# EAGLE schematic RCM-PBB_E1 (EAGLE 6.2)
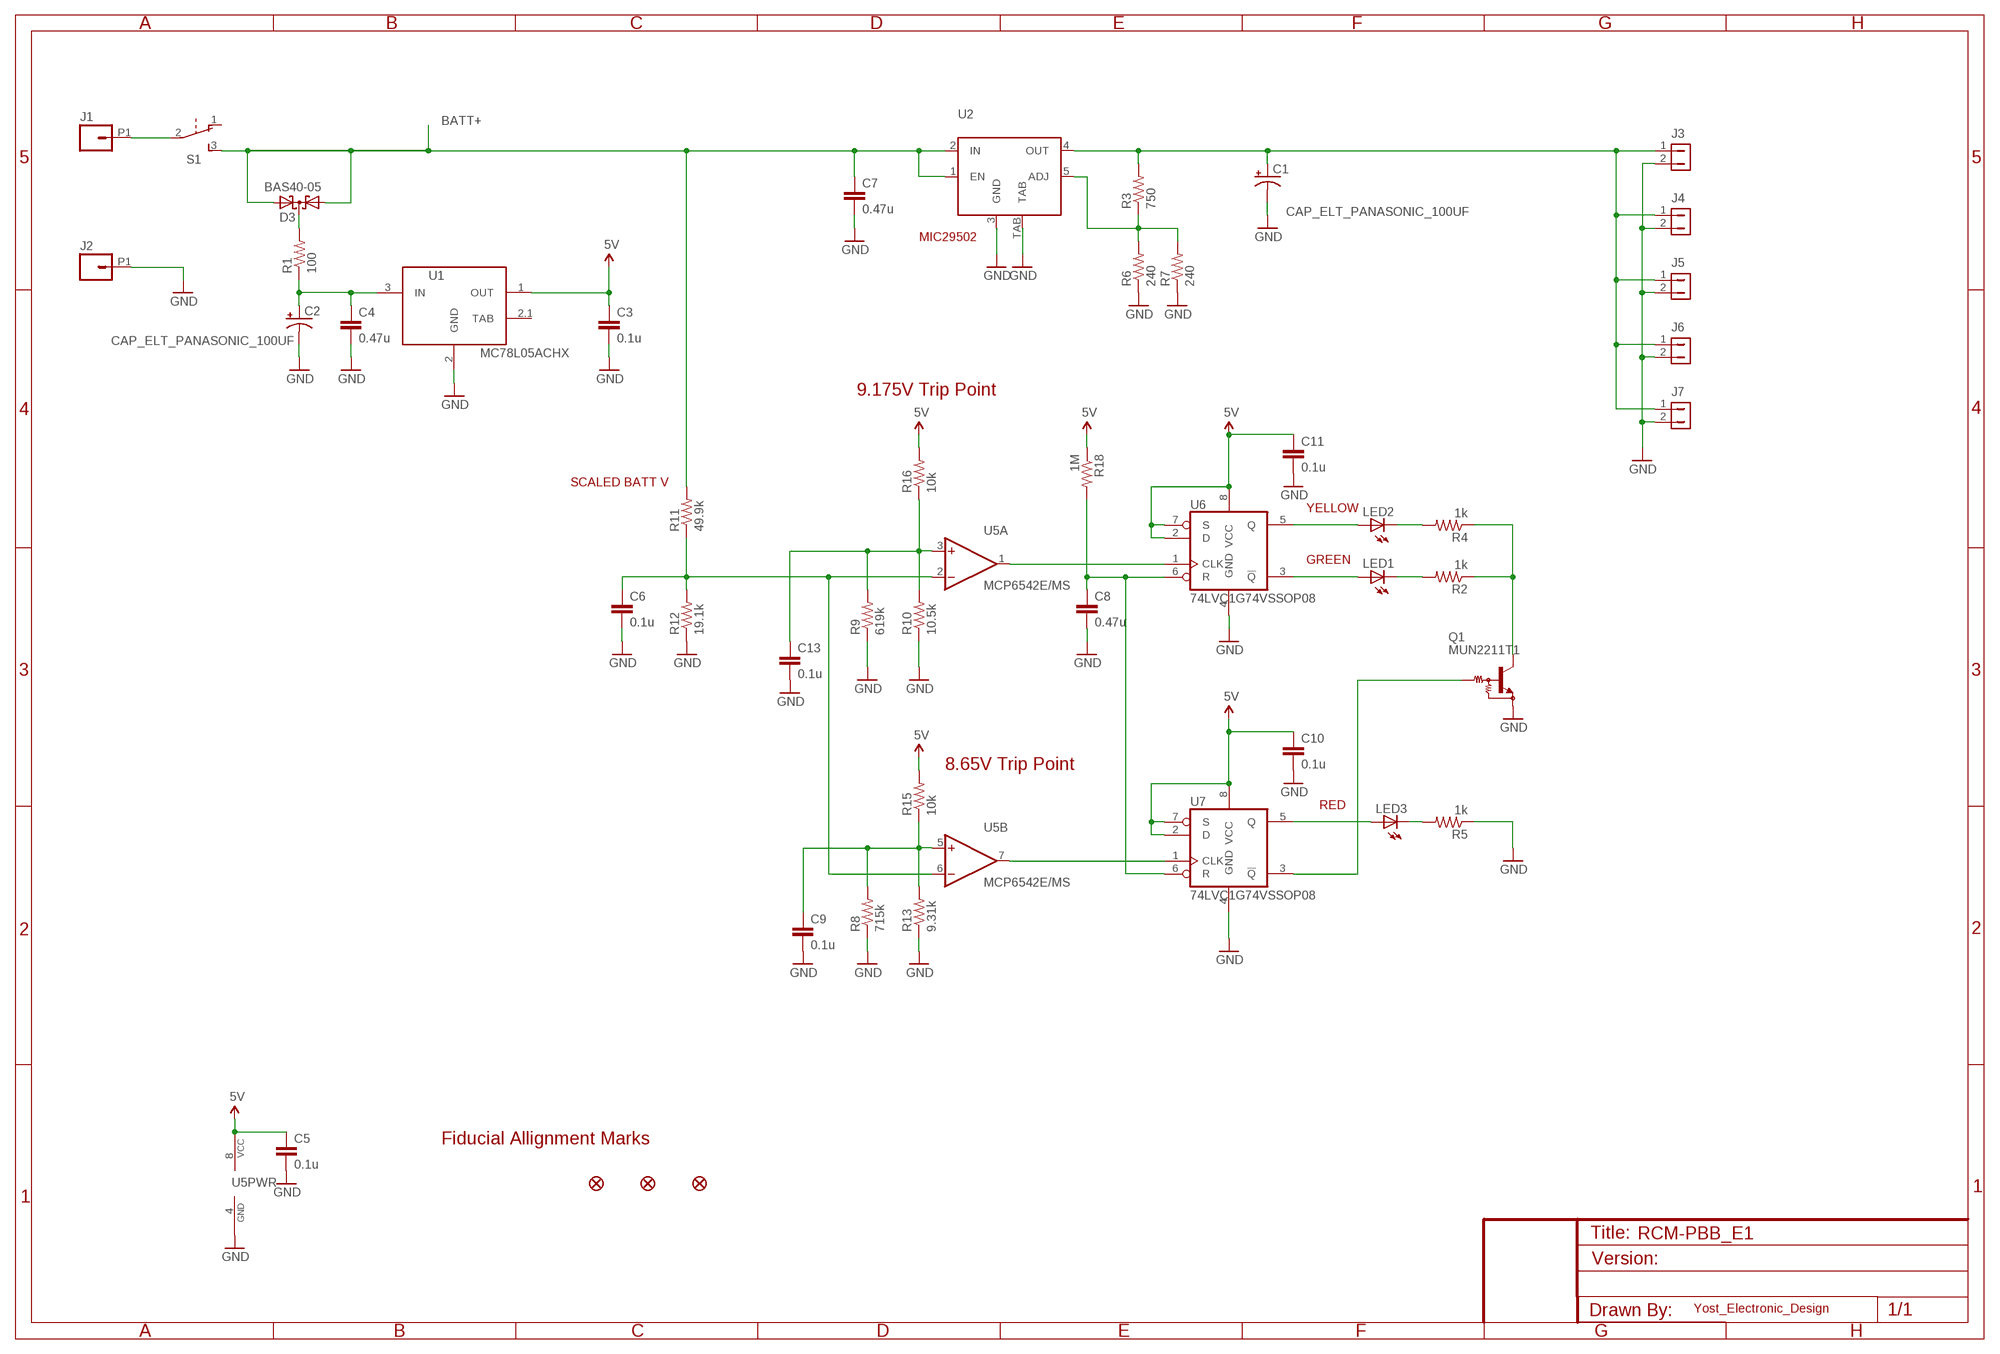
[diagram p0: schematic, sheet 1]

## Parts
C1  CAP_ELT_PANASONIC_100UF  [PANASONIC-D8-ELT-CAP]
C2  CAP_ELT_PANASONIC_100UF  [PANASONIC-D8-ELT-CAP]
C3  0.1u  CAP0805  [0805]
C4  0.47u  CAP0805  [0805]
C5  0.1u  CAP0805  [0805]
C6  0.1u  CAP0805  [0805]
C7  0.47u  CAP0805  [0805]
C8  0.47u  CAP0805  [0805]
C9  0.1u  CAP0805  [0805]
C10  0.1u  CAP0805  [0805]
C11  0.1u  CAP0805  [0805]
C13  0.1u  CAP0805  [0805]
D3  BAS40-05  [SOT23]
J1  ANDERSON_POWER_POLE  [ANDERSON_POWER_POLE]
J2  ANDERSON_POWER_POLE  [ANDERSON_POWER_POLE]
J3  CON1X2_SHROUDED  [HEADER_1X2_SHROUDED]
J4  CON1X2_SHROUDED  [HEADER_1X2_SHROUDED]
J5  CON1X2_SHROUDED  [HEADER_1X2_SHROUDED]
J6  CON1X2_SHROUDED  [HEADER_1X2_SHROUDED]
J7  CON1X2_SHROUDED  [HEADER_1X2_SHROUDED]
JP4  FIDUCIAL1X2.5  [FIDUCIAL-1X2.5]
JP5  FIDUCIAL1X2.5  [FIDUCIAL-1X2.5]
JP6  FIDUCIAL1X2.5  [FIDUCIAL-1X2.5]
LED1  LEDCHIPLED_0805  [CHIPLED_0805]
LED2  LEDCHIPLED_0805  [CHIPLED_0805]
LED3  LEDCHIPLED_0805  [CHIPLED_0805]
Q1  MUN2211T1  [SC59-BEC]
R1  100  RESISTOR  [0805]
R2  1k  RESISTOR  [0805]
R3  750  RESISTOR  [0805]
R4  1k  RESISTOR  [0805]
R5  1k  RESISTOR  [0805]
R6  240  RESISTOR  [0805]
R7  240  RESISTOR  [0805]
R8  715k  RESISTOR  [0805]
R9  619k  RESISTOR  [0805]
R10  10.5k  RESISTOR  [0805]
R11  49.9k  RESISTOR  [0805]
R12  19.1k  RESISTOR  [0805]
R13  9.31k  RESISTOR  [0805]
R15  10k  RESISTOR  [0805]
R16  10k  RESISTOR  [0805]
R18  1M  RESISTOR  [0805]
S1  SWITCH_SLIDE_ON_ON  [SWITCH_SLIDE_RA]
U1  MC78L05ACHX  [SOT89]
U2  MIC29502WU  [TO263-5]
U5  MCP6542E/MS  [MSOP8NOPAD]
U6  74LVC1G74VSSOP08  [VSSOP08]
U7  74LVC1G74VSSOP08  [VSSOP08]

## Nets
5V: C3.1 C5.1 C10.1 C11.1 R15.2 R16.2 R18.1 U1.1(OUT) U5.8(PWR:VCC) U6.2(D) U6.7(S) U6.8(VCC) U7.2(D) U7.7(S) U7.8(VCC)
BATT+: C7.1 D3.1(A1) D3.2(A2) R11.2 S1.3(S) U2.1(EN) U2.2(IN)
GND: C1.- C2.- C3.2 C4.2 C5.2 C6.2 C7.2 C8.2 C9.2 C10.2 C11.2 C13.2 J2.P1 J3.2 J4.2 J5.2 J6.2 J7.2 Q1.E R5.1 R6.1 R7.1 R8.1 R9.1 R10.1 R12.1 R13.1 U1.2(GND) U2.3(GND) U2.TAB U5.4(PWR:GND) U6.4(GND) U7.4(GND)
N$1: D3.3(C) R1.2
N$2: C13.1 R9.2 R10.2 R16.1 U5.3(A:+IN)
N$4: LED1.C R2.2
N$5: U5.1(A:OUT) U6.1(CLK)
N$6: C8.1 R18.2 U6.6(R) U7.6(R)
N$7: U5.7(B:OUT) U7.1(CLK)
N$8: Q1.C R2.1 R4.1
N$9: C1.+ J3.1 J4.1 J5.1 J6.1 J7.1 R3.2 U2.4(OUT)
N$10: LED3.A U7.5(Q)
N$11: J1.P1 S1.2(P)
N$12: LED1.A U6.3(!Q)
N$14: C9.1 R8.2 R13.2 R15.1 U5.5(B:+IN)
N$15: LED3.C R5.2
N$18: C6.1 R11.1 R12.2 U5.2(A:-IN) U5.6(B:-IN)
N$20: C2.+ C4.1 R1.1 U1.3(IN)
N$21: LED2.C R4.2
N$22: LED2.A U6.5(Q)
N$23: Q1.B U7.3(!Q)
N$25: R3.1 R6.2 R7.2 U2.5(ADJ)
Unconnected: S1.1(O) U1.2.1(TAB)

## Notes on the sheet
- MIC29502
- 9.175V Trip Point
- SCALED BATT V
- YELLOW
- GREEN
- 8.65V Trip Point
- RED
- Fiducial Allignment Marks
- Yost_Electronic_Design

## Library data of the parts
C1 C2 = JLY Parts:CAP_ELT_PANASONIC_100UF: Panasonic 100uF, 35V, ELT, D8 Size, 0.26L x 0.26W x 0.307h. Part Number EEE-1VA101XP
C3-C11 C13 = SparkFun:CAP: Capacitor Standard 0603 ceramic capacitor, and 0.1" leaded capacitor.
D3 = diode:BAS40-05: Silicon Schottky Diodes General-purpose diode for high-speed switching
J1 J2 = JLY Parts:ANDERSON_POWER_POLE
J3-J7 = JLY Parts:CON1X2_SHROUDED: CONN HDR RT ANG 2POS .100 TIN, Shrouded, Molex 70553-0036
JP4-JP6 = SparkFun-Aesthetics:FIDUCIAL: Fiducial Alignment Points Various fiducial points for machine vision alignment.
LED1-LED3 = led:LED: LED OSRAM: - CHIPLED LG R971, LG N971, LY N971, LG Q971, LY Q971, LO R971, LY R971 LH N974, LH R974 LS Q976, LO Q976, LY Q976 LO Q996 - Hyper CHIPLED LW Q18S LB Q993, LB Q99A, LB R99A - SideLED LS A670, LO A670, LY A670, LG A670, LP A670 LB A673, LV A673, LT A673, LW A673 LH A674 LY A675 LS A676, LA A676, LO A676, LY A676, LW A676 LS A679, LY A679, LG A679 - Hyper Micro SIDELED® LS Y876, LA Y876, LO Y876, LY Y876 LT Y87S - SmartLED LW L88C, LW L88S LB L89C, LB L89S, LG L890 LS L89K, LO L89K, LY L89K LS L896, LA L896, LO L896, LY L896 - TOPLED LS T670, LO T670, LY T670, LG T670, LP T670 LSG T670, LSP T670, LSY T670, LOP T670, LYG T670 LG T671, LOG T671, LSG T671 LB T673, LV T673, LT T673, LW T673 LH T674 LS T676, LA T676, LO T676, LY T676, LB T676, LH T676, LSB T676, LW T676 LB T67C, LV T67C, LT T67C, LS T67K, LO T67K, LY T67K, LW E67C LS E67B, LA E67B, LO E67B, LY E67B, LB E67C, LV E67C, LT E67C LW T67C LS T679, LY T679, LG T679 LS T770, LO T770, LY T770, LG T770, LP T770 LB T773, LV T773, LT T773, LW T773 LH T774 LS E675, LA E675, LY E675, LS T675 LS T776, LA T776, LO T776, LY T776, LB T776 LHGB T686 LT T68C, LB T68C - Hyper Mini TOPLED® LB M676 - Mini TOPLED Santana® LG M470 LS M47K, LO M47K, LY M47K Source: http://www.osram.convergy.de LUXEON: - LUMILED® LXK2-PW12-R00, LXK2-PW12-S00, LXK2-PW14-U00, LXK2-PW14-V00 LXK2-PM12-R00, LXK2-PM12-S00, LXK2-PM14-U00 LXK2-PE12-Q00, LXK2-PE12-R00, LXK2-PE12-S00, LXK2-PE14-T00, LXK2-PE14-U00 LXK2-PB12-K00, LXK2-PB12-L00, LXK2-PB12-M00, LXK2-PB14-N00, LXK2-PB14-P00, LXK2-PB14-Q00 LXK2-PR12-L00, LXK2-PR12-M00, LXK2-PR14-Q00, LXK2-PR14-R00 LXK2-PD12-Q00, LXK2-PD12-R00, LXK2-PD12-S00 LXK2-PH12-R00, LXK2-PH12-S00 LXK2-PL12-P00, LXK2-PL12-Q00, LXK2-PL12-R00 Source: www.luxeon.com KINGBRIGHT: KA-3528ASYC Source: www.kingbright.com
Q1 = transistor-npn:MUN2211*: NPN Bias Resistor Transistor
R1-R13 R15 R16 R18 = SparkFun:RESISTOR: Resistor Basic schematic elements and footprints for 0603, 1206, and PTH 1/10th watt (small) resistors.
S1 = JLY Parts:SWITCH_SLIDE_ON_ON: E-Switch Digikey EG2478-ND 500SSP1S1M6QEA SWITCH SLIDE SPDT SILVR 5A RTANG 500 E-Switch
U1 = JLY Parts:MC78L05ACHX: MC78L05ACHX. 30Vin, 5Vout, 100mA, SOT89
U2 = JLY_Parts:MIC29502WU: Regulator, Adj, LDO, MIC29502WU, Micrel, Digikey 576-1146-1-ND
U5 = JLY Parts:MCP6542E/MS: MCP6542-E/MS-ND MCP6542-E/MS IC COMP 1.6V DUAL P-P 8MSOP - Microchip Technology General Purpose CMOS, Push-Pull, Rail-to-Rail, TTL
U6 U7 = JLY Parts:74LVC1G74: 568-4494-1-ND 74LVC1G74DC,125 IC SNGL D FF POS-EDG TRIG 8VSSOP 74LVC NXP Semiconductors